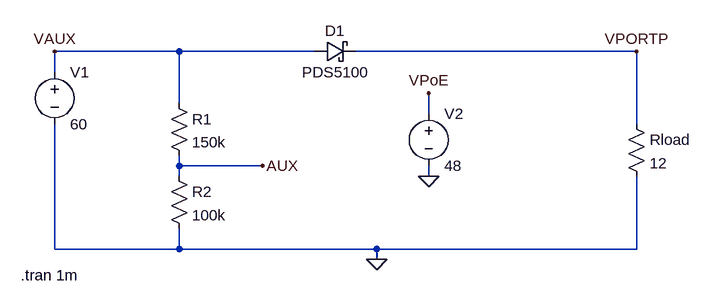
[diagram p0: schematic auxiliary_source.asc]
auxiliary_source.asc, the LTspice schematic file:
Version 4
SHEET 1 880 680
WIRE 80 64 -112 64
WIRE 288 64 80 64
WIRE 784 64 352 64
WIRE -112 96 -112 64
WIRE 80 144 80 64
WIRE 464 160 464 128
WIRE 784 176 784 64
WIRE 80 240 80 224
WIRE 208 240 80 240
WIRE 80 256 80 240
WIRE 464 256 464 240
WIRE -112 368 -112 176
WIRE 80 368 80 336
WIRE 80 368 -112 368
WIRE 384 368 80 368
WIRE 784 368 784 256
WIRE 784 368 384 368
WIRE 384 384 384 368
FLAG 464 256 0
FLAG 384 384 0
FLAG 464 128 VPoE
FLAG 784 64 VPORTP
FLAG -112 64 VAUX
FLAG 208 240 AUX
SYMBOL voltage -112 80 R0
SYMATTR InstName V1
SYMATTR Value 60
SYMBOL voltage 464 144 R0
SYMATTR InstName V2
SYMATTR Value 48
SYMBOL schottky 288 80 R270
WINDOW 0 32 32 VTop 2
WINDOW 3 0 32 VBottom 2
SYMATTR InstName D1
SYMATTR Value PDS5100
SYMATTR Description Diode
SYMATTR Type diode
SYMBOL res 64 128 R0
SYMATTR InstName R1
SYMATTR Value 150k
SYMBOL res 64 240 R0
SYMATTR InstName R2
SYMATTR Value 100k
SYMBOL res 768 160 R0
SYMATTR InstName Rload
SYMATTR Value 12
TEXT -164 408 Left 2 !.tran 1m

The netlist it stands for:
* auxiliary_source.asc
V1 VAUX 0 60
V2 VPoE 0 48
D1 VAUX VPORTP PDS5100
R1 VAUX AUX 150k
R2 AUX 0 100k
Rload VPORTP 0 12
.model D D
.lib standard.dio
.tran 1m
.backanno
.end